# EAGLE design micro_board (EAGLE 6.4)
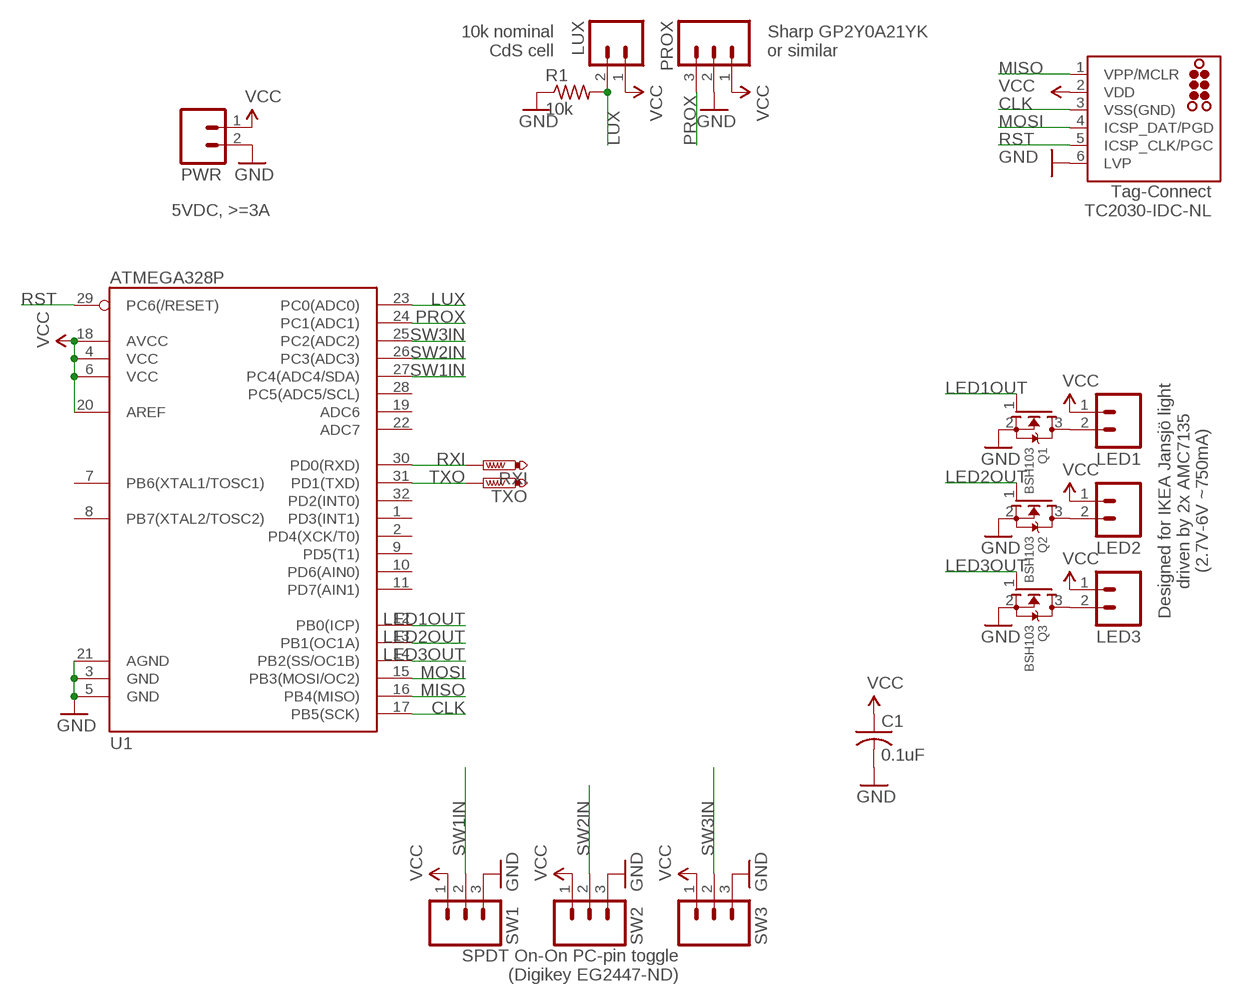
[diagram p0: schematic, sheet 1]

## Parts
C1  0.1uF  C-USC0603  [C0603]
J1  TC2030-MCP-NL  [TC2030-MCP-NL]
LED1  M02POLAR_LOCK  [MOLEX-1X2_LOCK]
LED2  M02POLAR_LOCK  [MOLEX-1X2_LOCK]
LED3  M02POLAR_LOCK  [MOLEX-1X2_LOCK]
LUX  M02POLAR_LOCK  [MOLEX-1X2_LOCK]
PROX  M03POLAR_LOCK  [MOLEX-1X3_LOCK]
PWR  M02POLAR_LOCK  [MOLEX-1X2_LOCK]
Q1  BSH103  MOSFET-NREFLOW  [SOT23]
Q2  BSH103  MOSFET-NREFLOW  [SOT23]
Q3  BSH103  MOSFET-NREFLOW  [SOT23]
R1  10k  R-US_R0603  [R0603]
RXI  PTR1B1,27  [B1,27]
SW1  M031X03_NO_SILK  [1X03_NO_SILK]
SW2  M031X03_NO_SILK  [1X03_NO_SILK]
SW3  M031X03_NO_SILK  [1X03_NO_SILK]
TXO  PTR1B1,27  [B1,27]
U1  ATMEGA328P  ATMEGA328_SMT  [TQFP32-08]

## Nets
CLK: J1.3(VSS(GND)) U1.17(PB5(SCK))
GND: C1.2 J1.6(LVP) PROX.2 PWR.2 Q1.2(S) Q2.2(S) Q3.2(S) R1.1 SW1.3 SW2.3 SW3.3 U1.3(GND) U1.5(GND) U1.21(AGND)
LED1OUT: Q1.1(G) U1.12(PB0(ICP))
LED2OUT: Q2.1(G) U1.13(PB1(OC1A))
LED3OUT: Q3.1(G) U1.14(PB2(SS/OC1B))
LUX: LUX.2 R1.2 U1.23(PC0(ADC0))
MISO: J1.1(VPP/MCLR) U1.16(PB4(MISO))
MOSI: J1.4(ICSP_DAT/PGD) U1.15(PB3(MOSI/OC2))
N$1: LED1.2 Q1.3(D)
N$2: LED2.2 Q2.3(D)
N$3: LED3.2 Q3.3(D)
PROX: PROX.3 U1.24(PC1(ADC1))
RST: J1.5(ICSP_CLK/PGC) U1.29(PC6(/RESET))
RXI: RXI.TP U1.30(PD0(RXD))
SW1IN: SW1.2 U1.27(PC4(ADC4/SDA))
SW2IN: SW2.2 U1.26(PC3(ADC3))
SW3IN: SW3.2 U1.25(PC2(ADC2))
TXO: TXO.TP U1.31(PD1(TXD))
VCC: C1.1 J1.2(VDD) LED1.1 LED2.1 LED3.1 LUX.1 PROX.1 PWR.1 SW1.1 SW2.1 SW3.1 U1.4(VCC) U1.6(VCC) U1.18(AVCC) U1.20(AREF)
Unconnected: U1.1(PD3(INT1)) U1.2(PD4(XCK/T0)) U1.7(PB6(XTAL1/TOSC1)) U1.8(PB7(XTAL2/TOSC2)) U1.9(PD5(T1)) U1.10(PD6(AIN0)) U1.11(PD7(AIN1)) U1.19(ADC6) U1.22(ADC7) U1.28(PC5(ADC5/SCL)) U1.32(PD2(INT0))

## Notes on the sheet
- 10k nominal
  CdS cell
- Sharp GP2Y0A21YK
  or similar
- 5VDC, >=3A
- Tag-Connect
  TC2030-IDC-NL
- Designed for IKEA Jansjö light
  driven by 2x AMC7135
  (2.7V-6V ~750mA)
- SPDT On-On PC-pin toggle
  (Digikey EG2447-ND)

## Library data of the parts
C1 = rcl:C-US: CAPACITOR, American symbol
J1 = tag-connect:TC2030: TAG-CONNECT ICSP Connector Manufacturer: Tag-Connect <http://www.tag-connect.com> Cable for easy In-Circuit Serial Programming. Designed for Microchip ICD2, suitable for many others. Two variants - one "with legs" (for hands-free fit on PCB) and another "without legs" for quick programming. PAD Description 1 MCLR/Vpp 2 Vdd 3 GND 4 PGD (ISPDAT) 5 PGC (ISPCLK) 6 nc (used for LVP) ©2009 ROFA.cz - modified and updated by Robert Darlington ‹rdarlington@gmail.com›
LED1-LED3 LUX PWR = SparkFun-Connectors:M02: Standard 2-pin 0.1" header. Use with - straight break away headers ( PRT-00116) - right angle break away headers (PRT-00553) - swiss pins (PRT-00743) - machine pins (PRT-00117) - female headers (PRT-00115) Molex polarized connector foot print use with: PRT-08233 with associated crimp pins and housings. 2.54_SCREWTERM for use with PRT-10571. 3.5mm Screw Terminal footprints for PRT-08084 5mm Screw Terminal footprints for use with PRT-08433
PROX SW1-SW3 = SparkFun-Connectors:M03: Header 3 Standard 3-pin 0.1" header. Use with straight break away headers (SKU : PRT-00116), right angle break away headers (PRT-00553), swiss pins (PRT-00743), machine pins (PRT-00117), and female headers (PRT-00115). Molex polarized connector foot print use with SKU : PRT-08232 with associated crimp pins and housings.
Q1-Q3 = adafruit:MOSFET-N: N-Channel Mosfet 2N7002E - 60V 260mA SOT23 [Digikey: 2N7002ET1GOSTR-ND] - REEL BSH103 - 30V 850mA SOT23 [Digikey: 568-5013-1-ND]
R1 = rcl:R-US_: RESISTOR, American symbol
RXI TXO = testpad:PTR1: TEST PIN
U1 = SparkFun-DigitalIC:ATMEGA328_SMT: 32-Pin Atmega328 part Commonly used on Arduino compatible boards Available in QFP and QFN packages TQFP is IC-09069 QFN is non-stock; PROD_ID: IC-09069

## Board
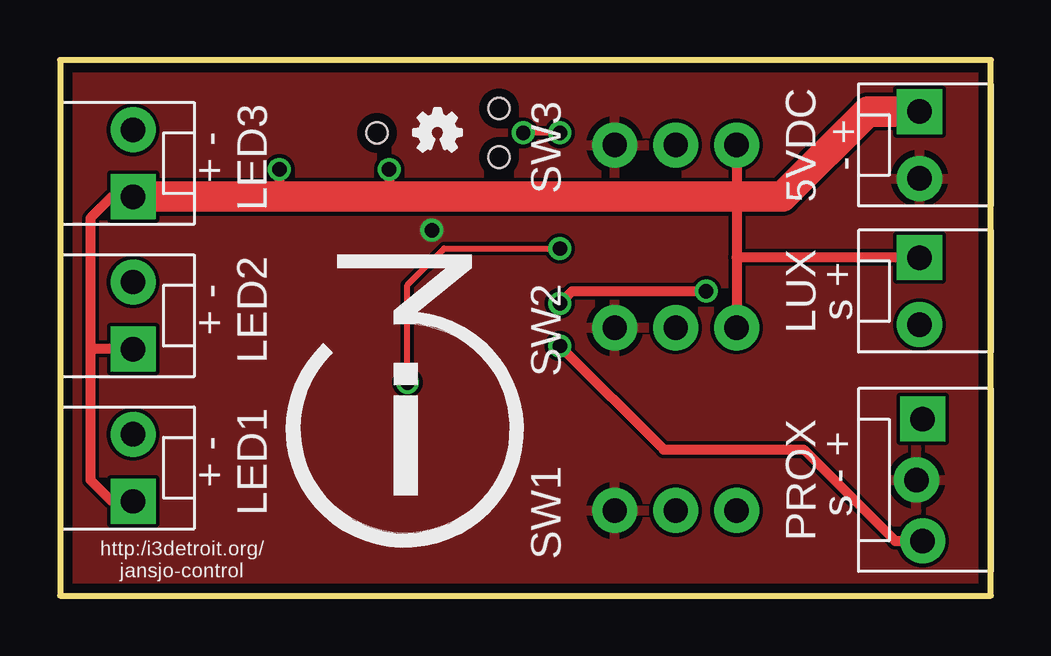
[diagram p1: board, top side]
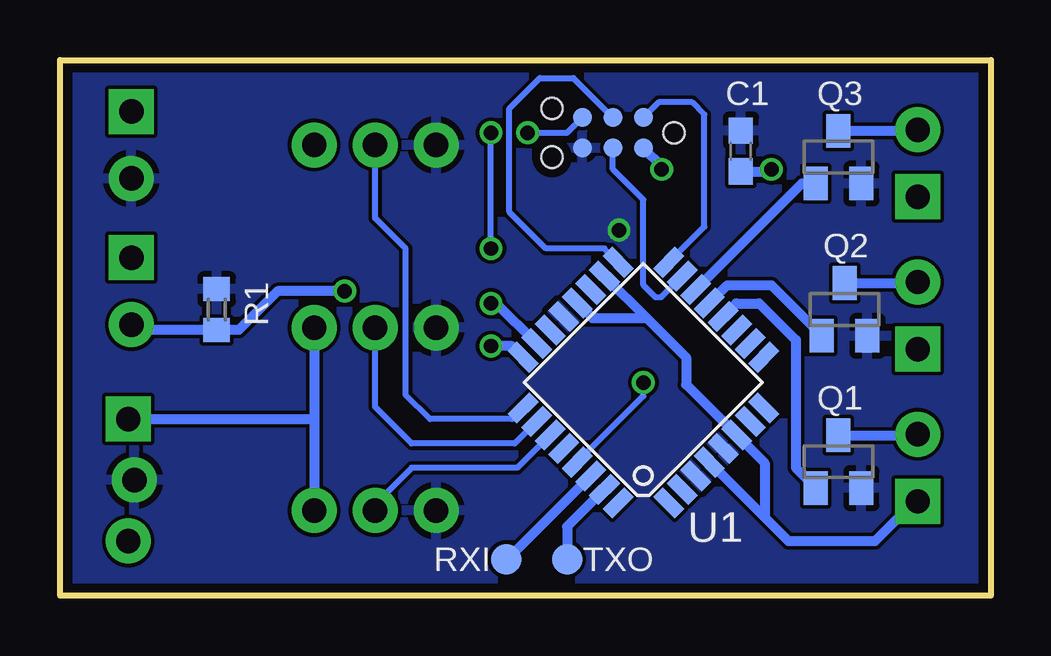
[diagram p2: board, bottom side, seen from below]

Size 38.79 x 22.34 mm. Coordinates in mm from the lower left corner, seen from the top.
Outline: 0,0 38.79,0 38.79,22.34 0,22.34 0,0
Copper layers (1*16): Top 0.0356mm / dielectric 1.5011mm / Bottom 0.0356mm
Design rules "LaenPCBOrder": minimum track width 6mil, minimum drill 13mil, track to track 6mil, track to pad 6mil, pad to pad 6mil, via to via 6mil, smd to smd 6mil, copper to edge 15mil, drill to drill 6mil, minimum pad ring 7mil, minimum via ring 7mil, stop-mask expansion 4mil, vias tented up to drill 0mil, thermal gap 10mil

### Footprints (pad centres in the part's own frame; a part is rotated, then mirrored left to right if it is on the bottom)
C0603 = smd 1.1 x 1: 1 -0.85,0; 2 0.85,0
TC2030-MCP-NL = smd 0.787 x 0.787: 1 1.27,-0.635; 2 1.27,0.635; 3 2.54,-0.635; 4 2.54,0.635; 5 3.81,-0.635; 6 3.81,0.635 | hole 0.889: 0,0; 5.08,-1.016; 5.08,1.016
MOLEX-1X2_LOCK = drill 1.016 pad 1.88 square: 1 -0.127,0 | drill 1.016 pad 1.88: 2 2.667,0
MOLEX-1X3_LOCK = drill 1.016 pad 1.88 square: 1 0,0.127 | drill 1.016 pad 1.88: 2 2.54,-0.127; 3 5.08,0.127
SOT23 = smd 1 x 1.4: 1 -0.95,-1.1; 2 0.95,-1.1; 3 0,1.1
R0603 = smd 1 x 1.1: 1 -0.85,0; 2 0.85,0
B1,27 = smd 1.27 x 1.27: TP 0,0
1X03_NO_SILK = drill 1.016 pad 1.88: 1 0,0; 2 2.54,0; 3 5.08,0
TQFP32-08 = smd 1.27 x 0.559: 1 -4.293,2.8; 2 -4.293,2; 3 -4.293,1.2; 4 -4.293,0.4; 5 -4.293,-0.4; 6 -4.293,-1.2; 7 -4.293,-2; 8 -4.293,-2.8; 17 4.293,-2.8; 18 4.293,-2; 19 4.293,-1.2; 20 4.293,-0.4; 21 4.293,0.4; 22 4.293,1.2; 23 4.293,2; 24 4.293,2.8 | smd 0.559 x 1.27: 9 -2.8,-4.293; 10 -2,-4.293; 11 -1.2,-4.293; 12 -0.4,-4.293; 13 0.4,-4.293; 14 1.2,-4.293; 15 2,-4.293; 16 2.8,-4.293; 25 2.8,4.293; 26 2,4.293; 27 1.2,4.293; 28 0.4,4.293; 29 -0.4,4.293; 30 -1.2,4.293; 31 -2,4.293; 32 -2.8,4.293

### Placement (x,y rotation side)
C1  10.41,18.54 90 bottom
J1  13.21,19.3 180 bottom
LED1  3.05,4.06 90 top
LED2  3.05,10.41 90 top
LED3  3.05,16.76 90 top
LUX  35.81,13.97 270 top
PROX  35.81,7.37 270 top
PWR  35.81,20.07 270 top
Q1  6.35,5.59 0 bottom
Q2  6.1,11.94 0 bottom
Q3  6.35,18.29 0 bottom
R1  32.26,11.94 270 bottom
RXI  20.19,1.52 180 bottom
SW1  28.19,3.56 180 top
SW2  28.19,11.18 180 top
SW3  28.19,18.8 180 top
TXO  17.65,1.52 180 bottom
U1  14.48,8.89 135 bottom
U$1  [OSHW_FILLX70_NOTEXT]  14.73,18.54 0 top

### Tracks (layer width: path | path; a pad name or v marks a point on that pad's centre or on a via)
CLK
  Bottom 0.254: J1.3 17.4,21.59 18.8,21.59 20.07,20.32 20.07,16 18.54,14.48 16.11,14.48 U1.17
GND  (via drill 0.6)
  other vias: 15.49,15.24
  pour Top: 0,0 38.86,0 38.86,22.35 0,22.35
  pour Bottom: 0,0 38.86,0 38.86,22.35 0,22.35
LED1OUT
  Bottom 0.406: U1.12 10.61,12.19 9.65,12.19 8.13,10.67 8.13,5.33 7.3,4.51 Q1.1
LED2OUT
  Bottom 0.406: 7.34,10.79 Q2.1 7.05,10.86 9.14,12.95 10.98,12.95 U1.13
LED3OUT
  Bottom 0.406: U1.14 7.88,17.19 Q3.1
LUX  (via drill 0.6)
  Top 0.406: v20.83,12.19 21.34,12.7 v26.92,12.7
  Bottom 0.406: LUX.2 35.6,11.09 R1.2 31.33,11.09 29.72,12.7 v26.92,12.7 | U1.23 20.61,12.19 v20.83,12.19
MISO
  Bottom 0.254: U1.16 11.94,15.39 11.94,20.07 12.45,20.57 13.84,20.57 J1.1
MOSI
  Bottom 0.254: U1.15 13.75,12.45 13.97,12.45 14.48,12.95 14.48,16.51 15.75,17.78 J1.4
N$1
  Bottom 0.406: Q1.3 3.09,6.69 LED1.2
N$2
  Bottom 0.406: Q2.3 3.09,13.04 LED2.2
N$3
  Bottom 0.406: Q3.3 3.09,19.39 LED3.2
PROX  (via drill 0.6)
  Top 0.406: v20.83,10.41 25.15,6.1 30.99,6.1 34.8,2.29 PROX.3
  Bottom 0.406: U1.24 19.96,10.41 v20.83,10.41
RST  (via drill 0.6)
  Top 0.254: v14.48,8.89 14.48,12.95 16,14.48 v20.83,14.48 | v20.83,19.3 v19.3,19.3
  Bottom 0.254: U1.29 14.48,8.32 v14.48,8.89 | v20.83,14.48 v20.83,19.3 | v19.3,19.3 17.65,19.3 J1.5
RXI
  Bottom 0.406: U1.30 20.15,1.52 RXI.TP
SW1IN
  Bottom 0.254: U1.27 19.73,5.33 24.13,5.33 25.65,3.81 SW1.2
SW2IN
  Bottom 0.254: U1.26 19.85,6.35 24.13,6.35 25.65,7.87 SW2.2
SW3IN
  Bottom 0.254: U1.25 19.96,7.37 23.37,7.37 24.38,8.38 24.38,14.48 25.65,15.75 SW3.2
TXO
  Bottom 0.406: U1.31 17.65,2.89 TXO.TP
VCC  (via drill 0.6)
  Top 0.406: LED3.1 2.16,16.64 1.27,15.75 1.27,10.41 | 1.27,10.41 1.27,4.83 2.16,3.94 LED1.1 | LED2.1 1.4,10.29 1.27,10.41 | 28.19,14.12 28.19,16.64 SW3.1 | 28.19,14.12 SW2.1 | LUX.1 28.22,14.1 28.19,14.12 | v9.14,17.78 9.14,16.64 | v13.72,17.78 13.72,16.64
  Top 1.27: LED3.1 9.14,16.64 13.72,16.64 28.19,16.64 30.1,16.64 33.66,20.19 PWR.1
  Bottom 0.406: SW2.1 28.19,7.37 | 28.19,7.37 SW1.1 | PROX.1 28.19,7.37 | C1.1 9.23,17.69 v9.14,17.78 | U1.4 9.43,3.27 | 9.43,3.27 8.44,2.29 4.83,2.29 3.17,3.94 LED1.1 | 9.43,3.27 9.43,5.54 U1.6 12.7,8.81 12.7,9.94 14.33,11.57 | U1.18 14.33,11.57 | U1.20 16.6,11.57 14.33,11.57 | J1.2 13.72,17.91 v13.72,17.78

### Text on the board
_tsilk: 5VDC | - + | + - | LED3 | LUX | s + | + - | LED2 | + - | LED1 | PROX | s - + | http:/i3detroit.org/ / jansjo-control